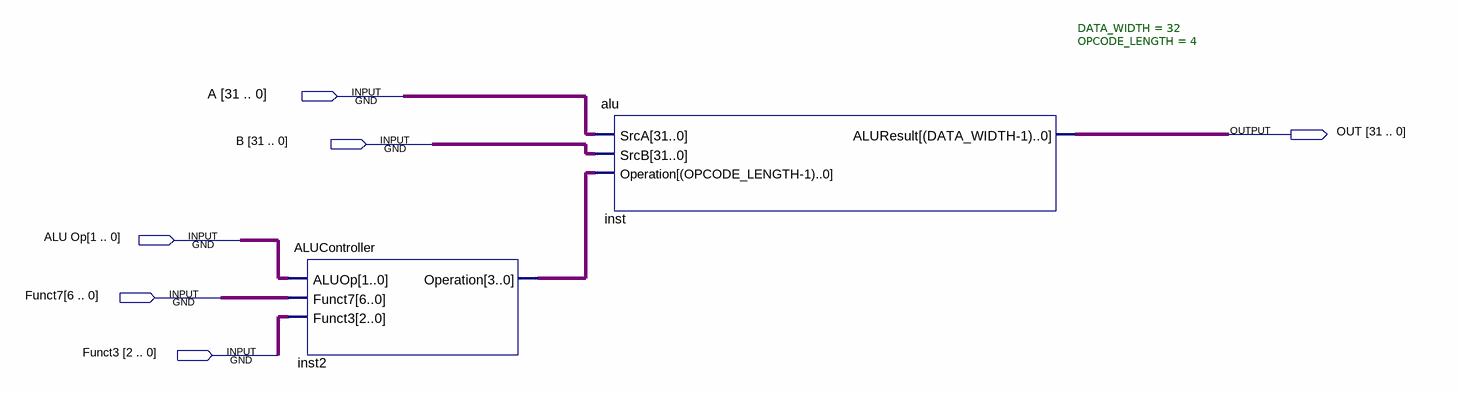
[diagram p0: schematic sheet]
// Quartus schematic ALUsim.bdf as structural Verilog: 2 symbols, 6 pins
module ALUsim (
  input  [31:0] A,
  input  [31:0] B,
  input  [1:0] \ALU_Op ,
  input  [6:0] Funct7,
  input  [2:0] Funct3,
  output [31:0] OUT
);

  wire [3:0] inst2_operation;

  ALUController inst2 (.ALUOp(\ALU_Op ), .Funct7(Funct7), .Funct3(Funct3), .Operation(inst2_operation));
  alu #(.DATA_WIDTH(32), .OPCODE_LENGTH(4)) inst (.SrcA(A), .SrcB(B), .Operation(inst2_operation), .ALUResult(OUT));
endmodule
